# EAGLE schematic Mainboard_v2 (EAGLE 6.3)
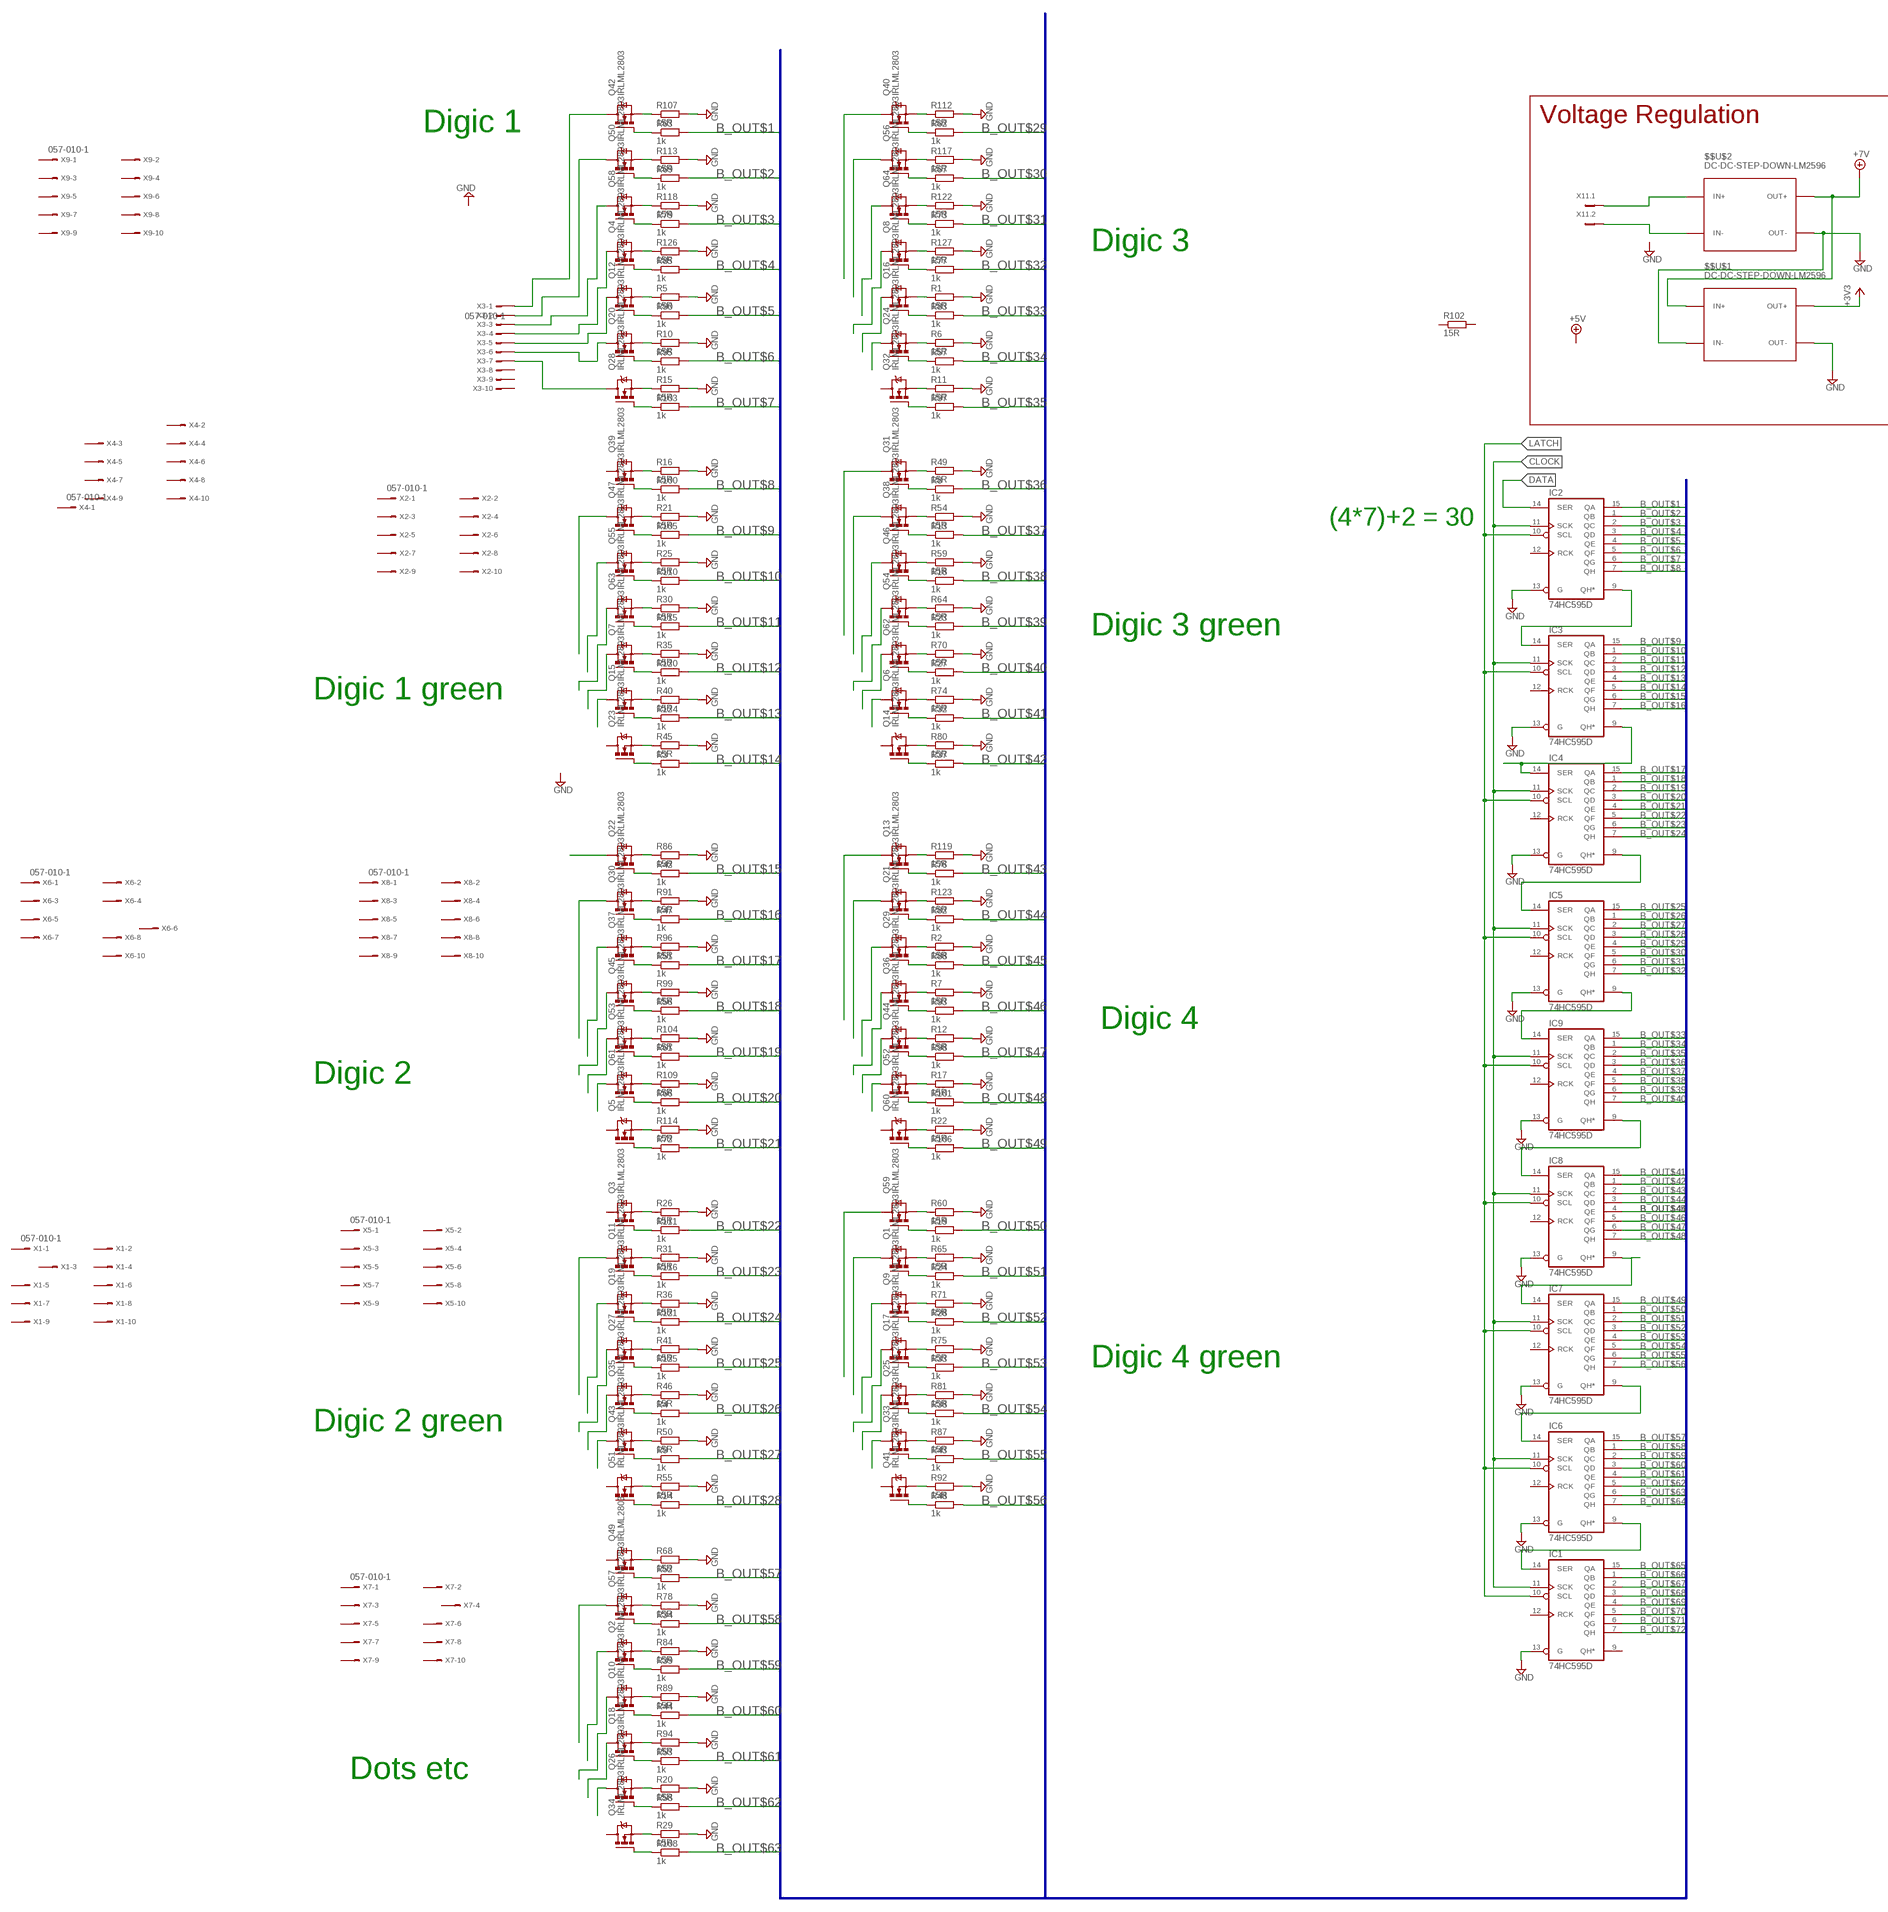
[diagram p0: schematic, sheet 1, part 1 of 2]
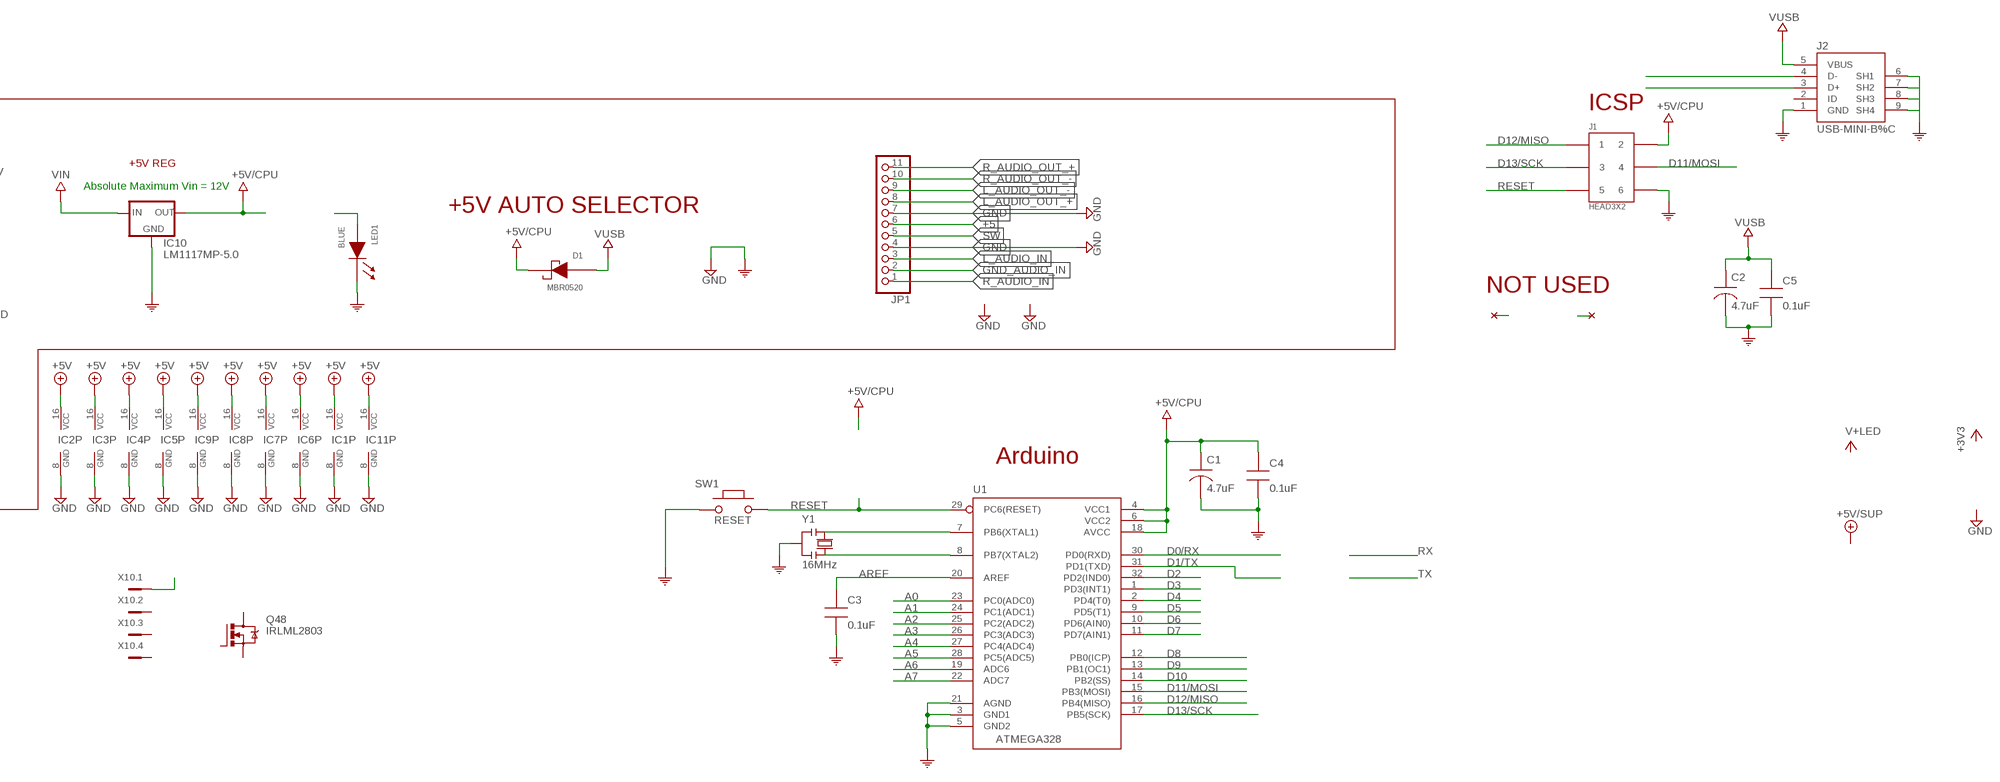
[diagram p1: schematic, sheet 1, part 2 of 2]

## Parts
$$U$1  DC-DC-STEP-DOWN-LM2596  [DC-DC-STEP-DOWN-LM2596]
$$U$2  DC-DC-STEP-DOWN-LM2596  [DC-DC-STEP-DOWN-LM2596]
C1  4.7uF  CAP-TANA-P  [TAN-A]
C2  4.7uF  CAP-TANA-P  [TAN-A]
C3  0.1uF  CAP0805-NP  [CAP0805-NP]
C4  0.1uF  CAP0805-NP  [CAP0805-NP]
C5  0.1uF  CAP0805-NP  [CAP0805-NP]
D1  MBR0520  [SOD-123]
IC1  74HC595D  [SO16]
IC2  74HC595D  [SO16]
IC3  74HC595D  [SO16]
IC4  74HC595D  [SO16]
IC5  74HC595D  [SO16]
IC6  74HC595D  [SO16]
IC7  74HC595D  [SO16]
IC8  74HC595D  [SO16]
IC9  74HC595D  [SO16]
IC10  LM1117MP-5.0  [SOT223]
IC11  74HC595D  [SO16]
J1  HEAD3X2  [HEAD3X2]
J2  USB-MINI-B%C  [USB-MINI-B_2]
JP1  PINHD-1X11_2.00  [1X11M]
LED1  BLUE  LED0805  [LED0805]
Q1  IRLML2803  [MICRO3]
Q2  IRLML2803  [MICRO3]
Q3  IRLML2803  [MICRO3]
Q4  IRLML2803  [MICRO3]
Q5  IRLML2803  [MICRO3]
Q6  IRLML2803  [MICRO3]
Q7  IRLML2803  [MICRO3]
Q8  IRLML2803  [MICRO3]
Q9  IRLML2803  [MICRO3]
Q10  IRLML2803  [MICRO3]
Q11  IRLML2803  [MICRO3]
Q12  IRLML2803  [MICRO3]
Q13  IRLML2803  [MICRO3]
Q14  IRLML2803  [MICRO3]
Q15  IRLML2803  [MICRO3]
Q16  IRLML2803  [MICRO3]
Q17  IRLML2803  [MICRO3]
Q18  IRLML2803  [MICRO3]
Q19  IRLML2803  [MICRO3]
Q20  IRLML2803  [MICRO3]
Q21  IRLML2803  [MICRO3]
Q22  IRLML2803  [MICRO3]
Q23  IRLML2803  [MICRO3]
Q24  IRLML2803  [MICRO3]
Q25  IRLML2803  [MICRO3]
Q26  IRLML2803  [MICRO3]
Q27  IRLML2803  [MICRO3]
Q28  IRLML2803  [MICRO3]
Q29  IRLML2803  [MICRO3]
Q30  IRLML2803  [MICRO3]
Q31  IRLML2803  [MICRO3]
Q32  IRLML2803  [MICRO3]
Q33  IRLML2803  [MICRO3]
Q34  IRLML2803  [MICRO3]
Q35  IRLML2803  [MICRO3]
Q36  IRLML2803  [MICRO3]
Q37  IRLML2803  [MICRO3]
Q38  IRLML2803  [MICRO3]
Q39  IRLML2803  [MICRO3]
Q40  IRLML2803  [MICRO3]
Q41  IRLML2803  [MICRO3]
Q42  IRLML2803  [MICRO3]
Q43  IRLML2803  [MICRO3]
Q44  IRLML2803  [MICRO3]
Q45  IRLML2803  [MICRO3]
Q46  IRLML2803  [MICRO3]
Q47  IRLML2803  [MICRO3]
Q48  IRLML2803  [MICRO3]
Q49  IRLML2803  [MICRO3]
Q50  IRLML2803  [MICRO3]
Q51  IRLML2803  [MICRO3]
Q52  IRLML2803  [MICRO3]
Q53  IRLML2803  [MICRO3]
Q54  IRLML2803  [MICRO3]
Q55  IRLML2803  [MICRO3]
Q56  IRLML2803  [MICRO3]
Q57  IRLML2803  [MICRO3]
Q58  IRLML2803  [MICRO3]
Q59  IRLML2803  [MICRO3]
Q60  IRLML2803  [MICRO3]
Q61  IRLML2803  [MICRO3]
Q62  IRLML2803  [MICRO3]
Q63  IRLML2803  [MICRO3]
Q64  IRLML2803  [MICRO3]
R1  15R  R-EU_M1206  [M1206]
R2  15R  R-EU_M1206  [M1206]
R3  1k  R-EU_M0805  [M0805]
R4  1k  R-EU_M0805  [M0805]
R5  15R  R-EU_M1206  [M1206]
R6  15R  R-EU_M1206  [M1206]
R7  15R  R-EU_M1206  [M1206]
R8  1k  R-EU_M0805  [M0805]
R9  1k  R-EU_M0805  [M0805]
R10  15R  R-EU_M1206  [M1206]
R11  15R  R-EU_M1206  [M1206]
R12  15R  R-EU_M1206  [M1206]
R13  1k  R-EU_M0805  [M0805]
R14  1k  R-EU_M0805  [M0805]
R15  15R  R-EU_M1206  [M1206]
R16  15R  R-EU_M1206  [M1206]
R17  15R  R-EU_M1206  [M1206]
R18  1k  R-EU_M0805  [M0805]
R19  1k  R-EU_M0805  [M0805]
R20  15R  R-EU_M1206  [M1206]
R21  15R  R-EU_M1206  [M1206]
R22  15R  R-EU_M1206  [M1206]
R23  1k  R-EU_M0805  [M0805]
R24  1k  R-EU_M0805  [M0805]
R25  15R  R-EU_M1206  [M1206]
R26  15R  R-EU_M1206  [M1206]
R27  1k  R-EU_M0805  [M0805]
R28  1k  R-EU_M0805  [M0805]
R29  15R  R-EU_M1206  [M1206]
R30  15R  R-EU_M1206  [M1206]
R31  15R  R-EU_M1206  [M1206]
R32  1k  R-EU_M0805  [M0805]
R33  1k  R-EU_M0805  [M0805]
R34  1k  R-EU_M0805  [M0805]
R35  15R  R-EU_M1206  [M1206]
R36  15R  R-EU_M1206  [M1206]
R37  1k  R-EU_M0805  [M0805]
R38  1k  R-EU_M0805  [M0805]
R39  1k  R-EU_M0805  [M0805]
R40  15R  R-EU_M1206  [M1206]
R41  15R  R-EU_M1206  [M1206]
R42  1k  R-EU_M0805  [M0805]
R43  1k  R-EU_M0805  [M0805]
R44  1k  R-EU_M0805  [M0805]
R45  15R  R-EU_M1206  [M1206]
R46  15R  R-EU_M1206  [M1206]
R47  1k  R-EU_M0805  [M0805]
R48  1k  R-EU_M0805  [M0805]
R49  15R  R-EU_M1206  [M1206]
R50  15R  R-EU_M1206  [M1206]
R51  1k  R-EU_M0805  [M0805]
R52  1k  R-EU_M0805  [M0805]
R53  1k  R-EU_M0805  [M0805]
R54  15R  R-EU_M1206  [M1206]
R55  15R  R-EU_M1206  [M1206]
R56  1k  R-EU_M0805  [M0805]
R57  1k  R-EU_M0805  [M0805]
R58  1k  R-EU_M0805  [M0805]
R59  15R  R-EU_M1206  [M1206]
R60  15R  R-EU_M1206  [M1206]
R61  1k  R-EU_M0805  [M0805]
R62  1k  R-EU_M0805  [M0805]
R63  1k  R-EU_M0805  [M0805]
R64  15R  R-EU_M1206  [M1206]
R65  15R  R-EU_M1206  [M1206]
R66  1k  R-EU_M0805  [M0805]
R67  1k  R-EU_M0805  [M0805]
R68  15R  R-EU_M1206  [M1206]
R69  1k  R-EU_M0805  [M0805]
R70  15R  R-EU_M1206  [M1206]
R71  15R  R-EU_M1206  [M1206]
R72  1k  R-EU_M0805  [M0805]
R73  1k  R-EU_M0805  [M0805]
R74  15R  R-EU_M1206  [M1206]
R75  15R  R-EU_M1206  [M1206]
R76  1k  R-EU_M0805  [M0805]
R77  1k  R-EU_M0805  [M0805]
R78  15R  R-EU_M1206  [M1206]
R79  1k  R-EU_M0805  [M0805]
R80  15R  R-EU_M1206  [M1206]
R81  15R  R-EU_M1206  [M1206]
R82  1k  R-EU_M0805  [M0805]
R83  1k  R-EU_M0805  [M0805]
R84  15R  R-EU_M1206  [M1206]
R85  1k  R-EU_M0805  [M0805]
R86  15R  R-EU_M1206  [M1206]
R87  15R  R-EU_M1206  [M1206]
R88  1k  R-EU_M0805  [M0805]
R89  15R  R-EU_M1206  [M1206]
R90  1k  R-EU_M0805  [M0805]
R91  15R  R-EU_M1206  [M1206]
R92  15R  R-EU_M1206  [M1206]
R93  1k  R-EU_M0805  [M0805]
R94  15R  R-EU_M1206  [M1206]
R95  1k  R-EU_M0805  [M0805]
R96  15R  R-EU_M1206  [M1206]
R97  1k  R-EU_M0805  [M0805]
R98  1k  R-EU_M0805  [M0805]
R99  15R  R-EU_M1206  [M1206]
R100  1k  R-EU_M0805  [M0805]
R101  1k  R-EU_M0805  [M0805]
R102  15R  R-EU_M1206  [M1206]
R103  1k  R-EU_M0805  [M0805]
R104  15R  R-EU_M1206  [M1206]
R105  1k  R-EU_M0805  [M0805]
R106  1k  R-EU_M0805  [M0805]
R107  15R  R-EU_M1206  [M1206]
R108  1k  R-EU_M0805  [M0805]
R109  15R  R-EU_M1206  [M1206]
R110  1k  R-EU_M0805  [M0805]
R111  1k  R-EU_M0805  [M0805]
R112  15R  R-EU_M1206  [M1206]
R113  15R  R-EU_M1206  [M1206]
R114  15R  R-EU_M1206  [M1206]
R115  1k  R-EU_M0805  [M0805]
R116  1k  R-EU_M0805  [M0805]
R117  15R  R-EU_M1206  [M1206]
R118  15R  R-EU_M1206  [M1206]
R119  15R  R-EU_M1206  [M1206]
R120  1k  R-EU_M0805  [M0805]
R121  1k  R-EU_M0805  [M0805]
R122  15R  R-EU_M1206  [M1206]
R123  15R  R-EU_M1206  [M1206]
R124  1k  R-EU_M0805  [M0805]
R125  1k  R-EU_M0805  [M0805]
R126  15R  R-EU_M1206  [M1206]
R127  15R  R-EU_M1206  [M1206]
SW1  RESET  PB157  [157SW]
U1  ATMEGA328  ATMEGA168-20AU  [QFP032]
X1  057-010-1  [057-010-1]
X2  057-010-1  [057-010-1]
X3  057-010-1  [057-010-1]
X4  057-010-1  [057-010-1]
X5  057-010-1  [057-010-1]
X6  057-010-1  [057-010-1]
X7  057-010-1  [057-010-1]
X8  057-010-1  [057-010-1]
X9  057-010-1  [057-010-1]
X10  MCV4-LOCK  [MCV4-LOCK]
X11  MCV2-LOCK  [MCV2-LOCK]
Y1  16MHz  RESONATORMU  [RESONATOR]

## Nets
+3V3: $$U$1.OUT+
+5: JP1.6
+5V: C1.1 C4.1 D1.1(CA) IC1.16(VCC) IC2.16(VCC) IC3.16(VCC) IC4.16(VCC) IC5.16(VCC) IC6.16(VCC) IC7.16(VCC) IC8.16(VCC) IC9.16(VCC) IC10.2(OUT) IC10.4(OUT) IC11.16(VCC) J1.2 U1.4(VCC1) U1.6(VCC2) U1.18(AVCC) ; supply symbol labelled +5V/CPU
+7V: $$U$1.IN+ $$U$2.OUT+
A0: U1.23(PC0(ADC0))
A1: U1.24(PC1(ADC1))
A2: U1.25(PC2(ADC2))
A3: U1.26(PC3(ADC3))
A4: U1.27(PC4(ADC4))
A5: U1.28(PC5(ADC5))
A6: U1.19(ADC6)
A7: U1.22(ADC7)
AREF: C3.1 U1.20(AREF)
B_OUT$1: IC2.15(QA) R63.2
B_OUT$2: IC2.1(QB) R69.2
B_OUT$3: IC2.2(QC) R79.2
B_OUT$4: IC2.3(QD) R85.2
B_OUT$5: IC2.4(QE) R90.2
B_OUT$6: IC2.5(QF) R95.2
B_OUT$7: IC2.6(QG) R103.2
B_OUT$8: IC2.7(QH) R100.2
B_OUT$9: IC3.15(QA) R105.2
B_OUT$10: IC3.1(QB) R110.2
B_OUT$11: IC3.2(QC) R115.2
B_OUT$12: IC3.3(QD) R120.2
B_OUT$13: IC3.4(QE) R124.2
B_OUT$14: IC3.5(QF) R3.2
B_OUT$15: IC3.6(QG) R42.2
B_OUT$16: IC3.7(QH) R47.2
B_OUT$17: IC4.15(QA) R51.2
B_OUT$18: IC4.1(QB) R56.2
B_OUT$19: IC4.2(QC) R61.2
B_OUT$20: IC4.3(QD) R66.2
B_OUT$21: IC4.4(QE) R72.2
B_OUT$22: IC4.5(QF) R111.2
B_OUT$23: IC4.6(QG) R116.2
B_OUT$24: IC4.7(QH) R121.2
B_OUT$25: IC5.15(QA) R125.2
B_OUT$26: IC5.1(QB) R4.2
B_OUT$27: IC5.2(QC) R9.2
B_OUT$28: IC5.3(QD) R14.2
B_OUT$29: IC5.4(QE) R62.2
B_OUT$30: IC5.5(QF) R67.2
B_OUT$31: IC5.6(QG) R73.2
B_OUT$32: IC5.7(QH) R77.2
B_OUT$33: IC9.15(QA) R83.2
B_OUT$34: IC9.1(QB) R57.2
B_OUT$35: IC9.2(QC) R97.2
B_OUT$36: IC9.3(QD) R8.2
B_OUT$37: IC9.4(QE) R13.2
B_OUT$38: IC9.5(QF) R18.2
B_OUT$39: IC9.6(QG) R23.2
B_OUT$40: IC9.7(QH) R27.2
B_OUT$41: IC8.15(QA) R32.2
B_OUT$42: IC8.1(QB) R37.2
B_OUT$43: IC8.2(QC) R76.2
B_OUT$44: IC8.3(QD) R82.2
B_OUT$45: IC8.4(QE) R88.2
B_OUT$46: IC8.5(QF) R93.2
B_OUT$47: IC8.6(QG) R98.2
B_OUT$48: IC8.7(QH) R101.2
B_OUT$49: IC7.15(QA) R106.2
B_OUT$50: IC7.1(QB) R19.2
B_OUT$51: IC7.2(QC) R24.2
B_OUT$52: IC7.3(QD) R28.2
B_OUT$53: IC7.4(QE) R33.2
B_OUT$54: IC7.5(QF) R38.2
B_OUT$55: IC7.6(QG) R43.2
B_OUT$56: IC7.7(QH) R48.2
B_OUT$57: IC6.15(QA) R52.2
B_OUT$58: IC6.1(QB) R34.2
B_OUT$59: IC6.2(QC) R39.2
B_OUT$60: IC6.3(QD) R44.2
B_OUT$61: IC6.4(QE) R53.2
B_OUT$62: IC6.5(QF) R58.2
B_OUT$63: IC6.6(QG) R108.2
B_OUT$64: IC6.7(QH)
B_OUT$65: IC1.15(QA)
B_OUT$66: IC1.1(QB)
B_OUT$67: IC1.2(QC)
B_OUT$68: IC1.3(QD)
B_OUT$69: IC1.4(QE)
B_OUT$70: IC1.5(QF)
B_OUT$71: IC1.6(QG)
B_OUT$72: IC1.7(QH)
CLOCK: IC1.11(SCK) IC2.11(SCK) IC3.11(SCK) IC4.11(SCK) IC5.11(SCK) IC6.11(SCK) IC7.11(SCK) IC8.11(SCK) IC9.11(SCK)
COM: C1.2 C2.2 C3.2 C4.2 C5.2 IC10.1(GND) J1.6 J2.1(GND) J2.6(SH1) J2.7(SH2) J2.8(SH3) J2.9(SH4) LED1.1(CA) SW1.1 U1.3(GND1) U1.5(GND2) U1.21(AGND) Y1.2
D0/RX: U1.30(PD0(RXD))
D1/TX: U1.31(PD1(TXD))
D2: U1.32(PD2(IND0))
D3: U1.1(PD3(INT1))
D4: U1.2(PD4(T0))
D5: U1.9(PD5(T1))
D6: U1.10(PD6(AIN0))
D7: U1.11(PD7(AIN1))
D8: U1.12(PB0(ICP))
D9: U1.13(PB1(OC1))
D10: U1.14(PB2(SS))
D11/MOSI: J1.4 U1.15(PB3(MOSI))
D12/MISO: J1.1 U1.16(PB4(MISO))
D13/SCK: J1.3 U1.17(PB5(SCK))
DATA: IC2.14(SER)
GND: $$U$1.IN- $$U$1.OUT- $$U$2.OUT- IC1.8(GND) IC1.13(G) IC2.8(GND) IC2.13(G) IC3.8(GND) IC3.13(G) IC4.8(GND) IC4.13(G) IC5.8(GND) IC5.13(G) IC6.8(GND) IC6.13(G) IC7.8(GND) IC7.13(G) IC8.8(GND) IC8.13(G) IC9.8(GND) IC9.13(G) IC11.8(GND) JP1.4 JP1.7 R1.2 R2.2 R5.2 R6.2 R7.2 R10.2 R11.2 R12.2 R15.2 R16.2 R17.2 R20.2 R21.2 R22.2 R25.2 R26.2 R29.2 R30.2 R31.2 R35.2 R36.2 R40.2 R41.2 R45.2 R46.2 R49.2 R50.2 R54.2 R55.2 R59.2 R60.2 R64.2 R65.2 R68.2 R70.2 R71.2 R74.2 R75.2 R78.2 R80.2 R81.2 R84.2 R86.2 R87.2 R89.2 R91.2 R92.2 R94.2 R96.2 R99.2 R104.2 R107.2 R109.2 R112.2 R113.2 R114.2 R117.2 R118.2 R119.2 R122.2 R123.2 R126.2 R127.2 ; supply symbol labelled COM
GND_AUDIO_IN: JP1.2
L_AUDIO_IN: JP1.3
L_AUDIO_OUT_+: JP1.8
L_AUDIO_OUT_-: JP1.9
LATCH: IC1.10(SCL) IC2.10(SCL) IC3.10(SCL) IC4.10(SCL) IC5.10(SCL) IC6.10(SCL) IC7.10(SCL) IC8.10(SCL) IC9.10(SCL)
N$1: U1.8(PB7(XTAL2)) Y1.3
N$2: U1.7(PB6(XTAL1)) Y1.1
N$3: LED1.2(AN)
N$4: $$U$2.IN+ X11.1
N$5: J2.3(D+)
N$6: J2.4(D-)
N$7: $$U$2.IN- X11.2
N$8: X10.1
N$9: Q40.2(S) R112.1
N$10: Q40.1(G) R62.1
N$11: IC2.9(QH*) IC3.14(SER)
N$12: Q56.2(S) R117.1
N$13: Q56.1(G) R67.1
N$14: IC3.9(QH*) IC4.14(SER)
N$15: Q64.2(S) R122.1
N$16: Q64.1(G) R73.1
N$17: IC5.9(QH*) IC9.14(SER)
N$18: Q8.2(S) R127.1
N$19: Q8.1(G) R77.1
N$20: IC4.9(QH*) IC5.14(SER)
N$21: Q16.2(S) R1.1
N$22: Q16.1(G) R83.1
N$23: IC8.14(SER) IC9.9(QH*)
N$26: Q24.2(S) R6.1
N$27: Q24.1(G) R57.1
N$28: IC7.14(SER) IC8.9(QH*)
N$29: Q32.2(S) R11.1
N$30: Q32.1(G) R97.1
N$31: IC6.14(SER) IC7.9(QH*)
N$33: Q24.3(D)
N$34: Q16.3(D)
N$35: Q8.3(D)
N$37: Q56.3(D)
N$38: Q40.3(D)
N$39: Q39.2(S) R16.1
N$40: Q39.1(G) R100.1
N$41: IC1.14(SER) IC6.9(QH*)
N$42: Q47.2(S) R21.1
N$43: Q47.1(G) R105.1
N$45: Q55.2(S) R25.1
N$46: Q55.1(G) R110.1
N$48: Q63.2(S) R30.1
N$49: Q63.1(G) R115.1
N$51: Q7.2(S) R35.1
N$52: Q7.1(G) R120.1
N$54: Q15.2(S) R40.1
N$55: Q15.1(G) R124.1
N$57: Q23.2(S) R45.1
N$58: Q23.1(G) R3.1
N$61: Q15.3(D)
N$62: Q7.3(D)
N$63: Q63.3(D)
N$64: Q55.3(D)
N$65: Q47.3(D)
N$67: Q31.2(S) R49.1
N$68: Q31.1(G) R8.1
N$70: Q38.2(S) R54.1
N$71: Q38.1(G) R13.1
N$73: Q46.2(S) R59.1
N$74: Q46.1(G) R18.1
N$76: Q54.2(S) R64.1
N$77: Q54.1(G) R23.1
N$79: Q62.2(S) R70.1
N$80: Q62.1(G) R27.1
N$82: Q6.2(S) R74.1
N$83: Q6.1(G) R32.1
N$85: Q14.2(S) R80.1
N$86: Q14.1(G) R37.1
N$89: Q6.3(D)
N$90: Q62.3(D)
N$91: Q54.3(D)
N$92: Q46.3(D)
N$93: Q38.3(D)
N$94: Q31.3(D)
N$95: Q22.2(S) R86.1
N$96: Q22.1(G) R42.1
N$98: Q30.2(S) R91.1
N$99: Q30.1(G) R47.1
N$101: Q37.2(S) R96.1
N$102: Q37.1(G) R51.1
N$104: Q45.2(S) R99.1
N$105: Q45.1(G) R56.1
N$107: Q53.2(S) R104.1
N$108: Q53.1(G) R61.1
N$110: Q61.2(S) R109.1
N$111: Q61.1(G) R66.1
N$113: Q5.2(S) R114.1
N$114: Q5.1(G) R72.1
N$117: Q61.3(D)
N$118: Q53.3(D)
N$119: Q45.3(D)
N$120: Q37.3(D)
N$121: Q30.3(D)
N$122: Q22.3(D)
N$123: Q13.2(S) R119.1
N$124: Q13.1(G) R76.1
N$126: Q21.2(S) R123.1
N$127: Q21.1(G) R82.1
N$129: Q29.2(S) R2.1
N$130: Q29.1(G) R88.1
N$132: Q36.2(S) R7.1
N$133: Q36.1(G) R93.1
N$135: Q44.2(S) R12.1
N$136: Q44.1(G) R98.1
N$138: Q52.2(S) R17.1
N$139: Q52.1(G) R101.1
N$141: Q60.2(S) R22.1
N$142: Q60.1(G) R106.1
N$145: Q52.3(D)
N$146: Q44.3(D)
N$147: Q36.3(D)
N$148: Q29.3(D)
N$149: Q21.3(D)
N$150: Q13.3(D)
N$151: Q3.2(S) R26.1
N$152: Q3.1(G) R111.1
N$154: Q11.2(S) R31.1
N$155: Q11.1(G) R116.1
N$157: Q19.2(S) R36.1
N$158: Q19.1(G) R121.1
N$160: Q27.2(S) R41.1
N$161: Q27.1(G) R125.1
N$163: Q35.2(S) R46.1
N$164: Q35.1(G) R4.1
N$166: Q43.2(S) R50.1
N$167: Q43.1(G) R9.1
N$169: Q51.2(S) R55.1
N$170: Q51.1(G) R14.1
N$173: Q43.3(D)
N$174: Q35.3(D)
N$175: Q27.3(D)
N$176: Q19.3(D)
N$177: Q11.3(D)
N$179: Q59.2(S) R60.1
N$180: Q59.1(G) R19.1
N$182: Q1.2(S) R65.1
N$183: Q1.1(G) R24.1
N$185: Q9.2(S) R71.1
N$186: Q9.1(G) R28.1
N$188: Q17.2(S) R75.1
N$189: Q17.1(G) R33.1
N$191: Q25.2(S) R81.1
N$192: Q25.1(G) R38.1
N$194: Q33.2(S) R87.1
N$195: Q33.1(G) R43.1
N$197: Q41.2(S) R92.1
N$198: Q41.1(G) R48.1
N$201: Q33.3(D)
N$202: Q25.3(D)
N$203: Q58.2(S) R118.1
N$204: Q42.2(S) R107.1
N$205: Q42.1(G) R63.1
N$207: Q58.1(G) R79.1
N$208: Q50.2(S) R113.1
N$209: Q50.1(G) R69.1
N$212: Q4.2(S) R126.1
N$213: Q4.1(G) R85.1
N$215: Q12.2(S) R5.1
N$216: Q12.1(G) R90.1
N$218: Q20.2(S) R10.1
N$219: Q20.1(G) R95.1
N$221: Q28.2(S) R15.1
N$222: Q28.1(G) R103.1
N$224: Q28.3(D) X3.7
N$225: Q20.3(D) X3.6
N$226: Q12.3(D) X3.5
N$227: Q4.3(D) X3.4
N$228: Q58.3(D) X3.3
N$229: Q50.3(D) X3.2
N$230: Q42.3(D) X3.1
N$231: Q17.3(D)
N$232: Q9.3(D)
N$233: Q1.3(D)
N$234: Q59.3(D)
N$235: Q49.2(S) R68.1
N$236: Q49.1(G) R52.1
N$238: Q57.2(S) R78.1
N$239: Q57.1(G) R34.1
N$241: Q2.2(S) R84.1
N$242: Q2.1(G) R39.1
N$244: Q10.2(S) R89.1
N$245: Q10.1(G) R44.1
N$247: Q18.2(S) R94.1
N$248: Q18.1(G) R53.1
N$250: Q26.2(S) R20.1
N$251: Q26.1(G) R58.1
N$253: Q34.2(S) R29.1
N$254: Q34.1(G) R108.1
N$257: Q26.3(D)
N$258: Q18.3(D)
N$259: Q10.3(D)
N$260: Q2.3(D)
N$261: Q57.3(D)
R_AUDIO_IN: JP1.1
R_AUDIO_OUT_+: JP1.11
R_AUDIO_OUT_-: JP1.10
RESET: J1.5 SW1.2 U1.29(PC6(RESET))
SW: JP1.5
VIN: IC10.3(IN)
VUSB: C2.1 C5.1 D1.2(AN) J2.5(VBUS)
X-D1G: Q64.3(D)
Unconnected: IC1.9(QH*) IC1.12(RCK) IC2.12(RCK) IC3.12(RCK) IC4.12(RCK) IC5.12(RCK) IC6.12(RCK) IC7.12(RCK) IC8.12(RCK) IC9.12(RCK) IC11.1(QB) IC11.2(QC) IC11.3(QD) IC11.4(QE) IC11.5(QF) IC11.6(QG) IC11.7(QH) IC11.9(QH*) IC11.10(SCL) IC11.11(SCK) IC11.12(RCK) IC11.13(G) IC11.14(SER) IC11.15(QA) J2.2(ID) Q3.3(D) Q5.3(D) Q14.3(D) Q23.3(D) Q32.3(D) Q34.3(D) Q39.3(D) Q41.3(D) Q48.1(G) Q48.2(S) Q48.3(D) Q49.3(D) Q51.3(D) Q60.3(D) R102.1 R102.2 X1.1 X1.2 X1.3 X1.4 X1.5 X1.6 X1.7 X1.8 X1.9 X1.10 X2.1 X2.2 X2.3 X2.4 X2.5 X2.6 X2.7 X2.8 X2.9 X2.10 X3.8 X3.9 X3.10 X4.1 X4.2 X4.3 X4.4 X4.5 X4.6 X4.7 X4.8 X4.9 X4.10 X5.1 X5.2 X5.3 X5.4 X5.5 X5.6 X5.7 X5.8 X5.9 X5.10 X6.1 X6.2 X6.3 X6.4 X6.5 X6.6 X6.7 X6.8 X6.9 X6.10 X7.1 X7.2 X7.3 X7.4 X7.5 X7.6 X7.7 X7.8 X7.9 X7.10 X8.1 X8.2 X8.3 X8.4 X8.5 X8.6 X8.7 X8.8 X8.9 X8.10 X9.1 X9.2 X9.3 X9.4 X9.5 X9.6 X9.7 X9.8 X9.9 X9.10 X10.2 X10.3 X10.4

## Buses
B_OUT$[1..72]

## Notes on the sheet
- ICSP
- Voltage Regulation
- Digic 1
- +5V REG
- Absolute Maximum Vin = 12V
- +5V AUTO SELECTOR
- Digic 3 | NOT USED
- Arduino
- (4*7)+2 = 30
- Digic 3 green
- Digic 1 green
- Digic 4
- Digic 2
- Digic 4 green
- Digic 2 green
- Dots etc

## Library data of the parts
$$U$1 $$U$2 = diy_modules:DC-DC-STEP-DOWN-LM2596: DC/DC Step-Down Regulator based on LM2596-ADJ chip
C1 C2 = MySMD:CAP-TANA-P
C3-C5 = MySMD:CAP0805-NP
D1 = MySMD:MBR0520
IC1-IC9 IC11 = 74xx-eu:74*595: 8-bit SHIFT REGISTER, output latch
IC10 = lm1117_10:LM1117?-*: 800mA Low-Dropout Linear Regulator Source: http://www.ti.com/lit/ds/symlink/lm1117-n.pdf; MF: Texas Instruments; MPN: LM1117MP-5.0; OC_FARNELL: 9778209; OC_NEWARK: 28X3417
J1 = MyCON2:HEAD3X2
J2 = MyCON2:USB-MINI-B
JP1 = pinhead-1:PINHD-1X11: PIN HEADER
LED1 = MySMD:LED0805
Q1-Q64 = irlml2803:IRLML2803: IRLML 2803 NFET HEXFET POWERMOSFET N-LogicLevel VDSS = 30V RDS(ON) = 0,25R SOT 23 1,2A max @ 25° Height = 1,1mm
R1-R127 = rcl:R-EU_: RESISTOR, European symbol
SW1 = MySMD:PB157
U1 = MySMD:ATMEGA168-20AU
X1-X9 = con-panduit:057-010-: CONNECTOR 10-pin series 057 contact pc board low profile headers; OC_FARNELL: unknown; OC_NEWARK: unknown
X10 = con-phoenix_3.81_mcv:MCV4-LOCK: Phoenix Contact: MCV 1.5/4-GF-3.81
X11 = con-phoenix_3.81_mcv:MCV2-LOCK: Phoenix Contact: MCV 1.5/2-GF-3.81
Y1 = MySMD2:RESONATOR